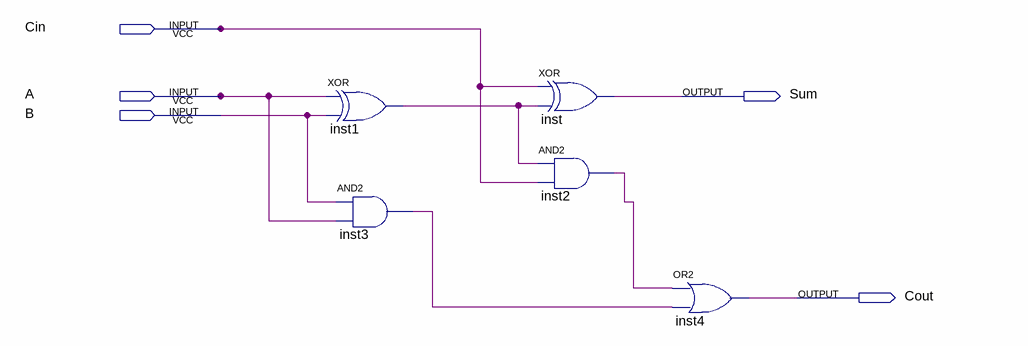
[diagram p0: schematic sheet]
// Quartus schematic Add1Bit.bdf as structural Verilog: 5 symbols, 5 pins
module Add1Bit (
  input  Cin,
  input  A,
  input  B,
  output Sum,
  output Cout
);

  wire inst1_out, inst2_out, inst3_out;

  xor inst1 (inst1_out, A, B);
  and inst3 (inst3_out, B, A);
  xor inst (Sum, Cin, inst1_out);
  and inst2 (inst2_out, inst1_out, Cin);
  or inst4 (Cout, inst2_out, inst3_out);
endmodule
